# EAGLE schematic arduino barebone (EAGLE 6.6.0)
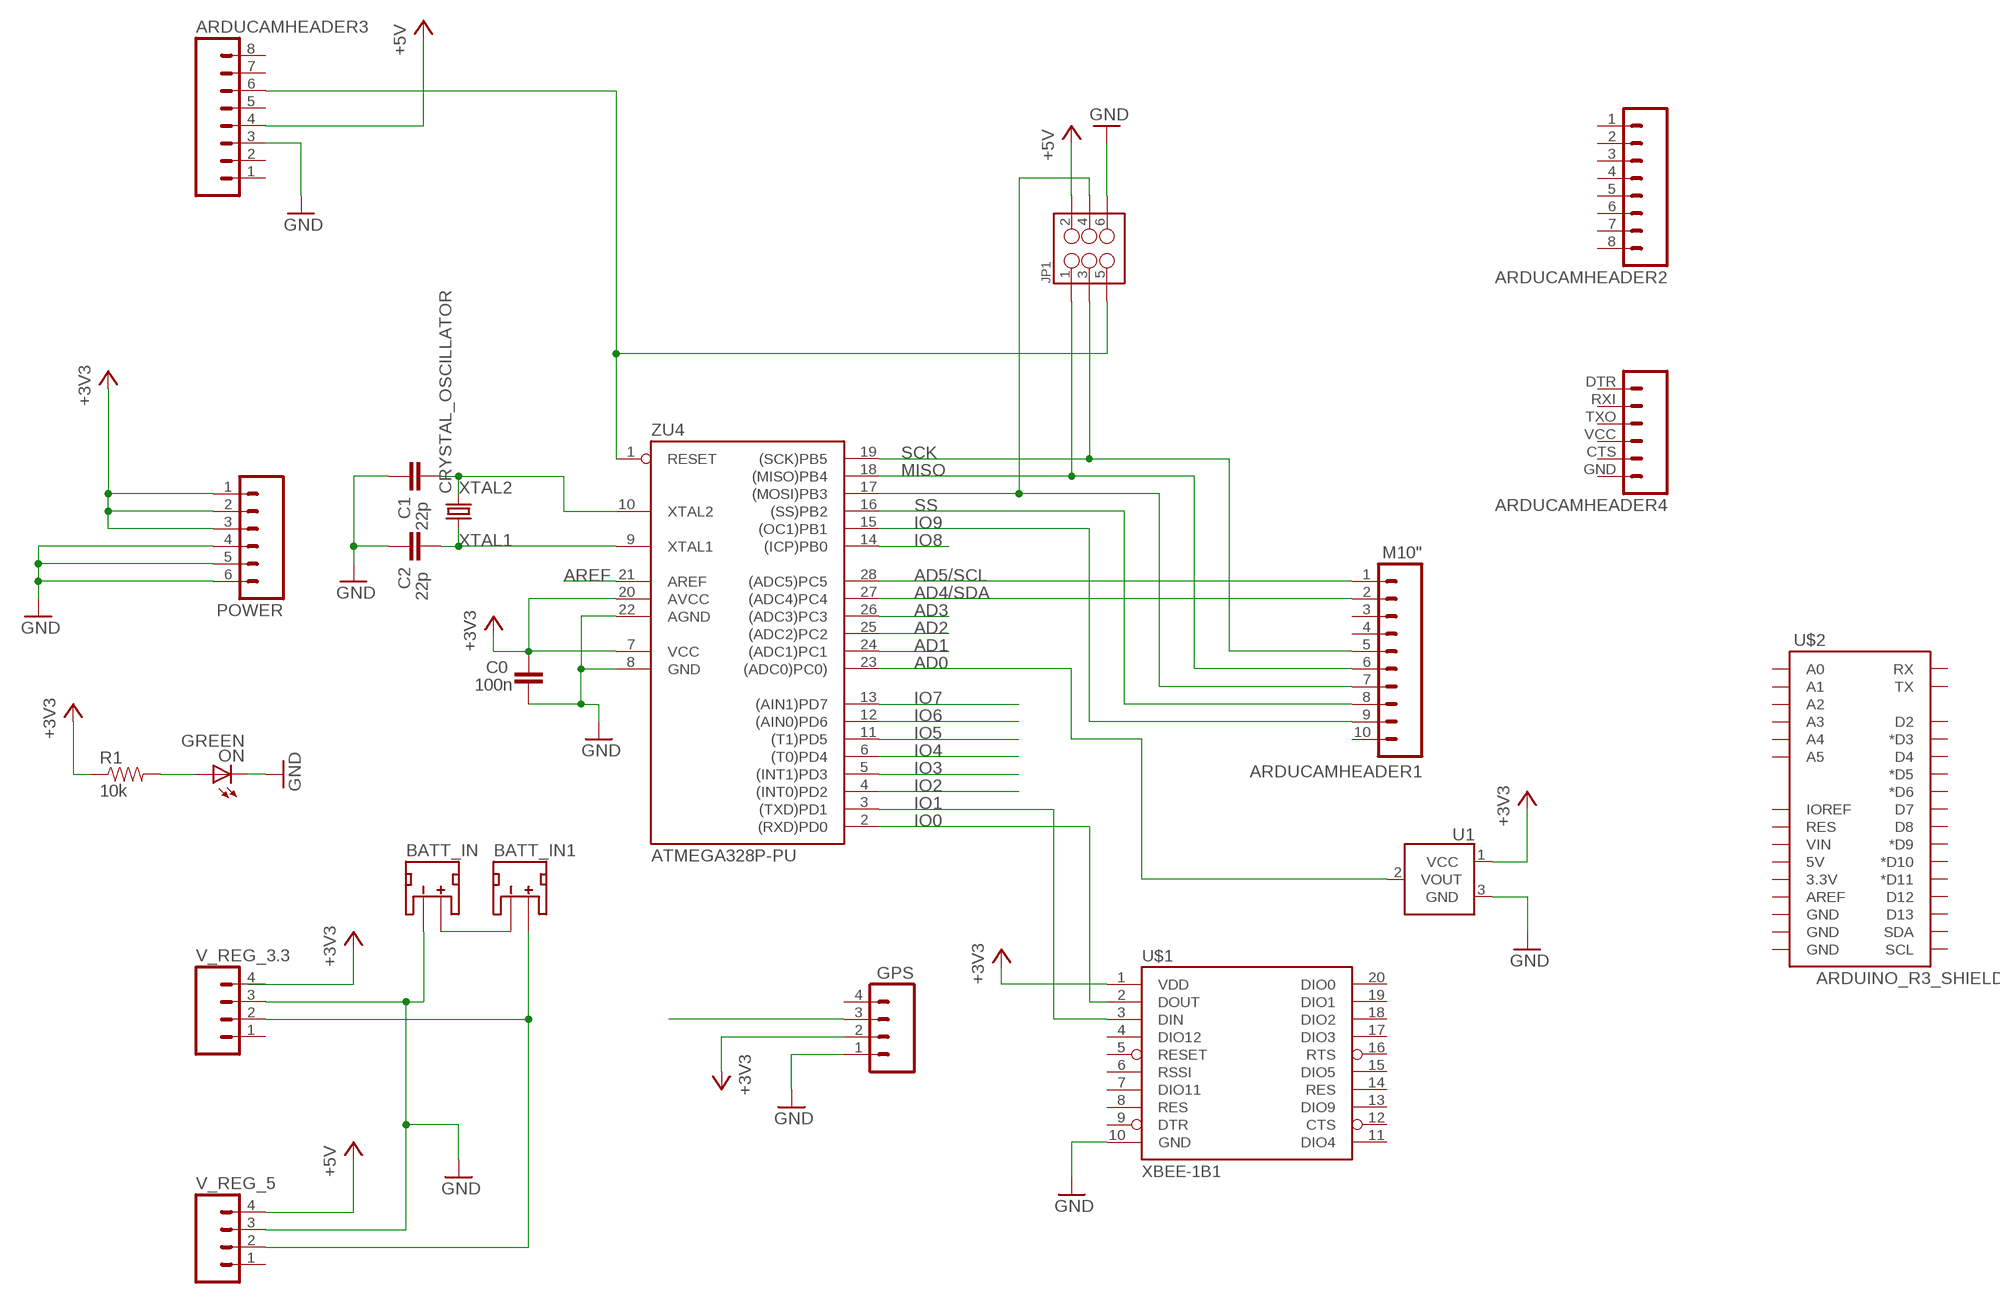
[diagram p0: schematic, sheet 1]

## Parts
ARDUCAMHEADER1  M10"  [1X10]
ARDUCAMHEADER2  M081X08  [1X08]
ARDUCAMHEADER3  M081X08  [1X08]
ARDUCAMHEADER4  M06SIP  [1X06]
BATT_IN  JST_2MM_MALE  [JST-2-SMD]
BATT_IN1  JST_2MM_MALE  [JST-2-SMD]
C0  100n  C-EU0603-RND  [C0603-ROUND]
C1  22p  C-EU0603-RND  [C0603-ROUND]
C2  22p  C-EU0603-RND  [C0603-ROUND]
CRYSTAL_OSCILLATOR  CRYSTALHC49US  [HC49US]
GPS  M04PTH  [1X04]
JP1  M03X2POGO_PINS  [2X3_POGO]
ON  GREEN  LEDCHIP-LED0805  [CHIP-LED0805]
POWER  M06LONGPADS  [1X06_LONGPADS]
R1  10k  RESISTOR  [0805]
U1  TMP36GT9  [TO-92]
U$1  XBEE-1B1  [XBEE-1]
U$2  ARDUINO_R3_SHIELD  [UNO_R3_SHIELD]
V_REG_3.3  M04PTH  [1X04]
V_REG_5  M04PTH  [1X04]
ZU4  ATMEGA328P-PU  [DIL28-3]

## Nets
+3V3: C0.2 GPS.2 POWER.1 POWER.2 POWER.3 R1.1 U1.1(VCC) U$1.1(VDD) V_REG_3.3.4 ZU4.7(VCC) ZU4.20(AVCC)
+5V: ARDUCAMHEADER3.4 JP1.P$2 V_REG_5.4
AD0: U1.2(VOUT) ZU4.23((ADC0)PC0))
AD1: ZU4.24((ADC1)PC1)
AD2: ZU4.25((ADC2)PC2)
AD3: ZU4.26((ADC3)PC3)
AD4/SDA: ARDUCAMHEADER1.2 ZU4.27((ADC4)PC4)
AD5/SCL: ARDUCAMHEADER1.1 ZU4.28((ADC5)PC5)
AREF [aref]: ZU4.21(AREF)
GND [gnd]: ARDUCAMHEADER3.3 BATT_IN.1(-) C0.1 C1.2 C2.2 GPS.1 JP1.P$6 ON.C POWER.4 POWER.5 POWER.6 U1.3(GND) U$1.10(GND) V_REG_3.3.3 V_REG_5.3 ZU4.8(GND) ZU4.22(AGND)
IO0: U$1.2(DOUT) ZU4.2((RXD)PD0)
IO1: U$1.3(DIN) ZU4.3((TXD)PD1)
IO2: ZU4.4((INT0)PD2)
IO3: ZU4.5((INT1)PD3)
IO4: ZU4.6((T0)PD4)
IO5: ZU4.11((T1)PD5)
IO6: ZU4.12((AIN0)PD6)
IO7: ZU4.13((AIN1)PD7)
IO8: ZU4.14((ICP)PB0)
IO9: ARDUCAMHEADER1.9 ZU4.15((OC1)PB1)
MISO: ARDUCAMHEADER1.6 JP1.P$1 ZU4.18((MISO)PB4)
N$1: ON.A R1.2
N$2: BATT_IN1.1(-) BATT_IN.2(+)
N$3: ARDUCAMHEADER1.7 JP1.P$4 ZU4.17((MOSI)PB3)
N$6: ARDUCAMHEADER3.6 JP1.P$5 ZU4.1(RESET)
SCK: ARDUCAMHEADER1.5 JP1.P$3 ZU4.19((SCK)PB5)
SOFTWARE_SERIAL: GPS.3
SS: ARDUCAMHEADER1.8 ZU4.16((SS)PB2)
V_IN: BATT_IN1.2(+) V_REG_3.3.2 V_REG_5.2
XTAL1: C2.1 CRYSTAL_OSCILLATOR.1 ZU4.9(XTAL1)
XTAL2: C1.1 CRYSTAL_OSCILLATOR.2 ZU4.10(XTAL2)
Unconnected: ARDUCAMHEADER1.3 ARDUCAMHEADER1.4 ARDUCAMHEADER1.10 ARDUCAMHEADER2.1 ARDUCAMHEADER2.2 ARDUCAMHEADER2.3 ARDUCAMHEADER2.4 ARDUCAMHEADER2.5 ARDUCAMHEADER2.6 ARDUCAMHEADER2.7 ARDUCAMHEADER2.8 ARDUCAMHEADER3.1 ARDUCAMHEADER3.2 ARDUCAMHEADER3.5 ARDUCAMHEADER3.7 ARDUCAMHEADER3.8 ARDUCAMHEADER4.CTS ARDUCAMHEADER4.DTR ARDUCAMHEADER4.GND ARDUCAMHEADER4.RXI ARDUCAMHEADER4.TXO ARDUCAMHEADER4.VCC BATT_IN1.NC1(PAD1) BATT_IN1.NC2(PAD2) BATT_IN.NC1(PAD1) BATT_IN.NC2(PAD2) GPS.4 U$1.4(DIO12) U$1.5(RESET) U$1.6(RSSI) U$1.7(DIO11) U$1.8(RES) U$1.9(DTR) U$1.11(DIO4) U$1.12(CTS) U$1.13(DIO9) U$1.14(RES) U$1.15(DIO5) U$1.16(RTS) U$1.17(DIO3) U$1.18(DIO2) U$1.19(DIO1) U$1.20(DIO0) U$2.3.3V U$2.5V U$2.A0 U$2.A1 U$2.A2 U$2.A3 U$2.A4 U$2.A5 U$2.AREF U$2.D2 U$2.D3(*D3) U$2.D4 U$2.D5(*D5) U$2.D6(*D6) U$2.D7 U$2.D8 U$2.D9(*D9) U$2.D10(*D10) U$2.D11(*D11) U$2.D12 U$2.D13 U$2.GND@0(GND) U$2.GND@1(GND) U$2.GND@2(GND) U$2.IOREF U$2.RES U$2.RX U$2.SCL U$2.SDA U$2.TX U$2.VIN V_REG_3.3.1 V_REG_5.1

## Library data of the parts
ARDUCAMHEADER1 = SparkFun-Connectors:M10: Header 10 Standard 10-pin 0.1" header. Use with straight break away headers (SKU : PRT-00116), right angle break away headers (PRT-00553), swiss pins (PRT-00743), machine pins (PRT-00117), and female headers (PRT-00115).
ARDUCAMHEADER2 ARDUCAMHEADER3 = SparkFun-Connectors:M08: Header 8 Standard 8-pin 0.1" header. Use with straight break away headers (SKU : PRT-00116), right angle break away headers (PRT-00553), swiss pins (PRT-00743), machine pins (PRT-00117), and female headers (PRT-00115).
ARDUCAMHEADER4 POWER = SparkFun-Connectors:M06: Header 6 Standard 6-pin 0.1" header. Use with straight break away headers (SKU : PRT-00116), right angle break away headers (PRT-00553), swiss pins (PRT-00743), machine pins (PRT-00117), and female headers (PRT-00115). Molex polarized connector foot print use with SKU : PRT-08094 with associated crimp pins and housings. NOTES ON THE VARIANTS LOCK and LOCK_LONGPADS... This footprint was designed to help hold the alignment of a through-hole component (i.e. 6-pin header) while soldering it into place. You may notice that each hole has been shifted either up or down by 0.005 of an inch from it's more standard position (which is a perfectly straight line). This slight alteration caused the pins (the squares in the middle) to touch the edges of the holes. Because they are alternating, it causes a "brace" to hold the component in place. 0.005 has proven to be the perfect amount of "off-center" position when using our standard breakaway headers. Although looks a little odd when you look at the bare footprint, once you have a header in there, the alteration is very hard to notice. Also,if you push a header all the way into place, it is covered up entirely on the bottom side. This idea of altering the position of holes to aid alignment will be further integrated into the Sparkfun Library for other footprints. It can help hold any component with 3 or more connection pins.
BATT_IN BATT_IN1 = SparkFun-Connectors:JST_2MM_MALE: Mates to single-cell LiPo batteries. CONN-08352; PROD_ID: CONN-08352
C0 C1 C2 = SmartPrj:C-EU: CAPACITOR, European symbol
CRYSTAL_OSCILLATOR = SparkFun-FreqCtrl:CRYSTAL: Various standard crystals. Proven footprints. Spark Fun Electronics SKU : COM-00534
GPS V_REG_3.3 V_REG_5 = SparkFun-Connectors:M04: Header 4 Standard 4-pin 0.1" header. Use with straight break away headers (SKU : PRT-00116), right angle break away headers (PRT-00553), swiss pins (PRT-00743), machine pins (PRT-00117), and female headers (PRT-00115). Molex polarized connector foot print use with SKU : PRT-08231 with associated crimp pins and housings. 1MM SMD Version SKU: PRT-10208
JP1 = SparkFun-Connectors:M03X2: 2x3 .1" header. Shrouded, with keying- CONN-10681 SMT- CONN-11415 Pogo pins- HW-11044; PROD_ID: HW-11044
ON = led:LED: LED OSRAM: - CHIPLED LG R971, LG N971, LY N971, LG Q971, LY Q971, LO R971, LY R971 LH N974, LH R974 LS Q976, LO Q976, LY Q976 LO Q996 - Hyper CHIPLED LW Q18S LB Q993, LB Q99A, LB R99A - SideLED LS A670, LO A670, LY A670, LG A670, LP A670 LB A673, LV A673, LT A673, LW A673 LH A674 LY A675 LS A676, LA A676, LO A676, LY A676, LW A676 LS A679, LY A679, LG A679 - Hyper Micro SIDELED® LS Y876, LA Y876, LO Y876, LY Y876 LT Y87S - SmartLED LW L88C, LW L88S LB L89C, LB L89S, LG L890 LS L89K, LO L89K, LY L89K LS L896, LA L896, LO L896, LY L896 - TOPLED LS T670, LO T670, LY T670, LG T670, LP T670 LSG T670, LSP T670, LSY T670, LOP T670, LYG T670 LG T671, LOG T671, LSG T671 LB T673, LV T673, LT T673, LW T673 LH T674 LS T676, LA T676, LO T676, LY T676, LB T676, LH T676, LSB T676, LW T676 LB T67C, LV T67C, LT T67C, LS T67K, LO T67K, LY T67K, LW E67C LS E67B, LA E67B, LO E67B, LY E67B, LB E67C, LV E67C, LT E67C LW T67C LS T679, LY T679, LG T679 LS T770, LO T770, LY T770, LG T770, LP T770 LB T773, LV T773, LT T773, LW T773 LH T774 LS E675, LA E675, LY E675, LS T675 LS T776, LA T776, LO T776, LY T776, LB T776 LHGB T686 LT T68C, LB T68C - Hyper Mini TOPLED® LB M676 - Mini TOPLED Santana® LG M470 LS M47K, LO M47K, LY M47K Source: http://www.osram.convergy.de LUXEON: - LUMILED® LXK2-PW12-R00, LXK2-PW12-S00, LXK2-PW14-U00, LXK2-PW14-V00 LXK2-PM12-R00, LXK2-PM12-S00, LXK2-PM14-U00 LXK2-PE12-Q00, LXK2-PE12-R00, LXK2-PE12-S00, LXK2-PE14-T00, LXK2-PE14-U00 LXK2-PB12-K00, LXK2-PB12-L00, LXK2-PB12-M00, LXK2-PB14-N00, LXK2-PB14-P00, LXK2-PB14-Q00 LXK2-PR12-L00, LXK2-PR12-M00, LXK2-PR14-Q00, LXK2-PR14-R00 LXK2-PD12-Q00, LXK2-PD12-R00, LXK2-PD12-S00 LXK2-PH12-R00, LXK2-PH12-S00 LXK2-PL12-P00, LXK2-PL12-Q00, LXK2-PL12-R00 Source: www.luxeon.com KINGBRIGHT: KA-3528ASYC Source: www.kingbright.com
R1 = SparkFun:RESISTOR: Resistor Basic schematic elements and footprints for 0603, 1206, and PTH 1/10th watt (small) resistors.
U1 = SparkFun-Sensors:TMP36: Precision degC temp sensor, analog out
U$1 = SparkFun:XBEE-1
U$2 = SparkFun-Boards:ARDUINO_R3_SHIELD: Shield form compatible with the Arduino Uno R3.
ZU4 = SmartPrj:ATMEGA328P-: MICROCONTROLLER 4 Kbytes FLASH 128 bytes SRAM 256 bytes EEPROM UART 6-channel 10 bit ADC

## Net classes
0 default: width 0.254 mm, clearance 0.254 mm
1 power: width 0.61 mm, drill 0.61 mm, clearance 0.254 mm
2 gnd: width 0.305 mm, drill 0.559 mm, clearance 0.254 mm
3 usbvcc: width 0.508 mm, drill 0.61 mm, clearance 0.254 mm
4 aref: width 0.406 mm, drill 0.61 mm, clearance 0.254 mm